# Altium schematic sheet MCP2515_PINOUT.SchDoc
size A; SheetNumber: 6; SheetTotal: 21
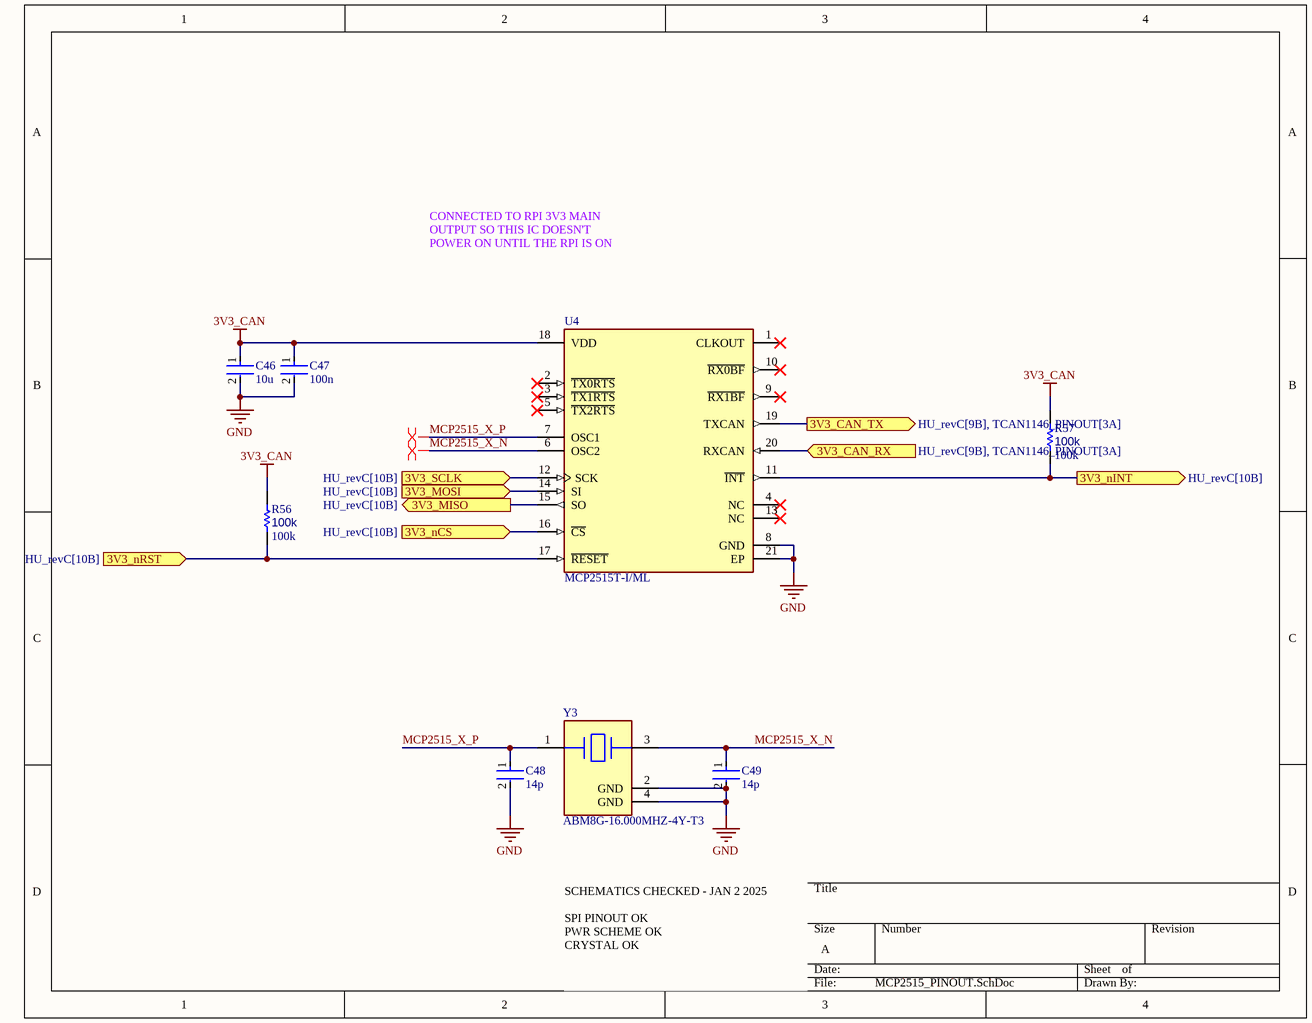
[diagram p0: MCP2515_PINOUT.SchDoc]

## Parts
C46  10u  [FP-0402-L_1_0_0_05-W_0_5-IPC_A]
C47  100n  [FP-0402-L_1_0_0_05-W_0_5-IPC_A]
C48  14p  [FP-0402-L_1_0_0_05-W_0_5-IPC_A]
C49  14p  [FP-0402-L_1_0_0_05-W_0_5-IPC_A]
R56  100k  [R0603B]
R57  100k  [R0603B]
U4  MCP2515T-I/ML  [FP-C04-126-MFG]
Y3  ABM8G-16.000MHZ-4Y-T3  [FP-ABM8G-MFG]

## Ports
3V3_CAN_RX (in, see HU_revC[9B], TCAN1146_PINOUT[3A]), 3V3_CAN_TX (out, see HU_revC[9B], TCAN1146_PINOUT[3A]), 3V3_MISO (out, see HU_revC[10B]), 3V3_MOSI (in, see HU_revC[10B]), 3V3_nCS (in, see HU_revC[10B]), 3V3_nINT (out, see HU_revC[10B]), 3V3_nRST (in, see HU_revC[10B]), 3V3_SCLK (in, see HU_revC[10B])

## Nets
3V3_CAN: C46.1 C47.1 R56.1 R57.1 U4.18(VDD)
GND: C46.2 C47.2 C48.2 C49.2 U4.8(GND) U4.21(EP) Y3.2(GND) Y3.4(GND)
3V3_CAN_RX: U4.20(RXCAN) ; port 3V3_CAN_RX
3V3_CAN_TX: U4.19(TXCAN) ; port 3V3_CAN_TX
3V3_MISO: U4.15(SO) ; port 3V3_MISO
3V3_MOSI: U4.14(SI) ; port 3V3_MOSI
3V3_nCS: U4.16(~{CS}) ; port 3V3_nCS
3V3_nINT: R57.2 U4.11(~{INT}) ; port 3V3_nINT
3V3_nRST: R56.2 U4.17(~{RESET}) ; port 3V3_nRST
3V3_SCLK: U4.12(SCK) ; port 3V3_SCLK
MCP2515_X_N: C49.1 U4.6(OSC2) Y3.3
MCP2515_X_P: C48.1 U4.7(OSC1) Y3.1

Not connected (* = marked no-connect by the designer): U4 1(CLKOUT)* 2(~{TX0RTS})* 3(~{TX1RTS})* 4(NC)* 5(~{TX2RTS})* 9(~{RX1BF})* 10(~{RX0BF})* 13(NC)*

## Layout directives
differential pair: MCP2515_X_N, MCP2515_X_P

## Notes on the sheet
- CONNECTED TO RPI 3V3 MAIN OUTPUT SO THIS IC DOESN'T POWER ON UNTIL THE RPI IS ON
- SCHEMATICS CHECKED - JAN 2 2025
  SPI PINOUT OK
  PWR SCHEME OK
  CRYSTAL OK

## Library data of the parts
C46-C49 = CMP-001-00058-1: LARGE PADS, 0402 CAP, CHANGE COMMENT TO MATCH REAL P/N; Capacitor Type: Ceramic; Min Operating Temperature: -55°C; Mounting Technology: Surface Mount; Pins: 2; Case/Package: 0402; RoHS Compliant: Yes; Max Operating Temperature: 85°C
R56 R57 = CMP-009-00002-14: Resistor; Value: 100k
U4 = CMP-0186-00186-2: IC CAN CTLR W/SPI 2.0B 20-QFN; Max Supply Voltage: 5.5V; Max Supply Current: 10mA; Number of Transceivers: 1; Min Supply Voltage: 2.7V; Data Rate: 1000Kbps; Interface: SPI; Mount: Surface Mount; Packaging: Tape and Reel; Lead Free: Lead Free; Package Quantity: 3300; Case/Package: QFN; Max Operating Temperature: 85°C; Number of Pins: 20; Min Operating Temperature: -40°C; Contact Plating: Tin; Radiation Hardening: No; Nominal Supply Current: 10mA
Y3 = CMP-27762-015134-1: Crystal 16MHz ±30ppm (Tol) ±30ppm (Stability) 10pF FUND 80Ω 4-Pin SMD T/R; Series Resistance: 80R; Mount: Surface Mount; Width: 0.098inch; Load Capacitance: 10pF; Length: 3.2mm; Series: ABM8G; Max Operating Temperature: 60°C; Depth: 2.5mm; Frequency: 16MHz; Frequency Tolerance: 30ppm; Height: 0.039inch; ESR (Equivalent Series Resistance): 80R; Case/Package: SMD/SMT; Lead Free: Lead Free; Frequency Stability: 30ppm; Packaging: Tape and Reel; Number of Pins: 4; REACH SVHC: No SVHC; Min Operating Temperature: -10°C